# Altium schematic sheet Snippet_STMF103C8T6.SchDoc
size 840 x 594 mm
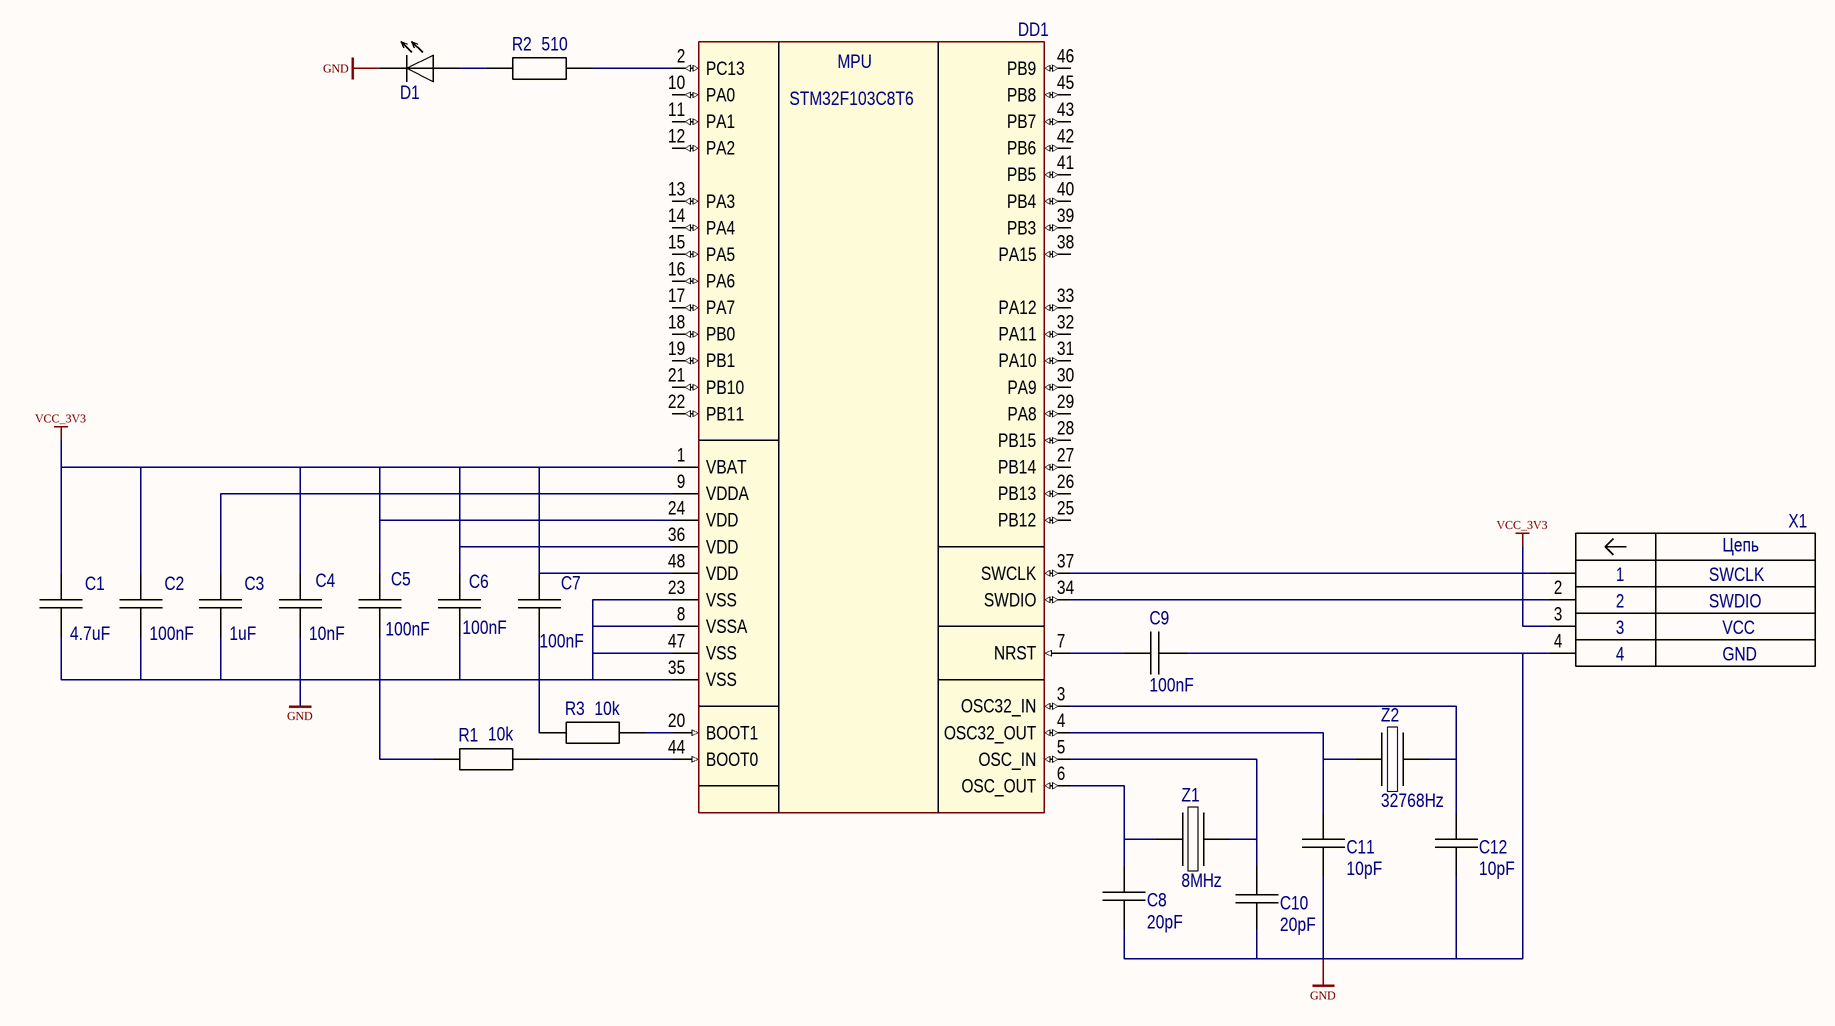
[diagram p0: Snippet_STMF103C8T6.SchDoc]

## Parts
C1  4.7uF  [Capacitor_0805]
C2  100nF  [Capacitor_0805]
C3  1uF  [Capacitor_0805]
C4  10nF  [Capacitor_0805]
C5  100nF  [Capacitor_0805]
C6  100nF  [Capacitor_0805]
C7  100nF  [Capacitor_0805]
C8  20pF  [Capacitor_0805]
C9  100nF  [Capacitor_0805]
C10  20pF  [Capacitor_0805]
C11  10pF  [Capacitor_0805]
C12  10pF  [Capacitor_0805]
D1  LED_0805_G  [LED_0805_G]  (value not drawn)
DD1  STM32F103C8T6  [LQFP48]  (value not drawn)
R1  10k  [RESISTOR_SMD0805]
R2  510  [RESISTOR_SMD0805]
R3  10k  [RESISTOR_SMD0805]
X1  Connector_PLS-4  [CONNECTOR_PLS-4]  (value not drawn)
Z1  8MHz  [Quartz_KX-9]
Z2  32768Hz  [Quartz_32768kHz]

## Nets
GND: C1.1 C2.1 C3.1 C4.1 C5.1 C6.1 C7.1 C8.1 C9.1 C10.2 C11.1 C12.1 D1.2 DD1.8(VSSA) DD1.23(VSS) DD1.35(VSS) DD1.47(VSS) R1.2 R3.2 X1.4
VCC_3V3: C1.2 C2.2 C3.2 C4.2 C5.2 C6.2 C7.2 DD1.1(VBAT) DD1.9(VDDA) DD1.24(VDD) DD1.36(VDD) DD1.48(VDD) X1.3
NetC8_2: C8.2 DD1.6(OSC_OUT) Z1.1
NetC9_2: C9.2 DD1.7(NRST)
NetC10_1: C10.1 DD1.5(OSC_IN) Z1.3
NetC11_2: C11.2 DD1.4(OSC32_OUT) Z2.2
NetC12_2: C12.2 DD1.3(OSC32_IN) Z2.1
NetD1_1: D1.1 R2.2
NetDD1_2: DD1.2(PC13) R2.1
NetDD1_20: DD1.20(BOOT1) R3.1
NetDD1_34: DD1.34(SWDIO) X1.2
NetDD1_37: DD1.37(SWCLK) X1.1
NetDD1_44: DD1.44(BOOT0) R1.1

Not connected (* = marked no-connect by the designer): DD1 10(PA0) 11(PA1) 12(PA2) 13(PA3) 14(PA4) 15(PA5) 16(PA6) 17(PA7) 18(PB0) 19(PB1) 21(PB10) 22(PB11) 25(PB12) 26(PB13) 27(PB14) 28(PB15) 29(PA8) 30(PA9) 31(PA10) 32(PA11) 33(PA12) 38(PA15) 39(PB3) 40(PB4) 41(PB5) 42(PB6) 43(PB7) 45(PB8) 46(PB9)

## Notes on the sheet
- (near X1) 1
- (near X1) 2
- (near X1) 3
- SWCLK
- SWDIO
- VCC
- (near X1) 4
- GND
- (in symbol Connector_PLS-4) Цепь
- (in symbol STM32F103C8T6) MPU

## Library data of the parts
C1-C12 = Capacitor_0805
D1 = LED_0805_G: KP-2012MGC
R1-R3 = Resistor_0805
Z1 = Quartz_KX-9A
Z2 = Quartz_32678Hz